# Altium schematic sheet power.SchDoc
size 420 x 297 mm; SheetNumber: 3
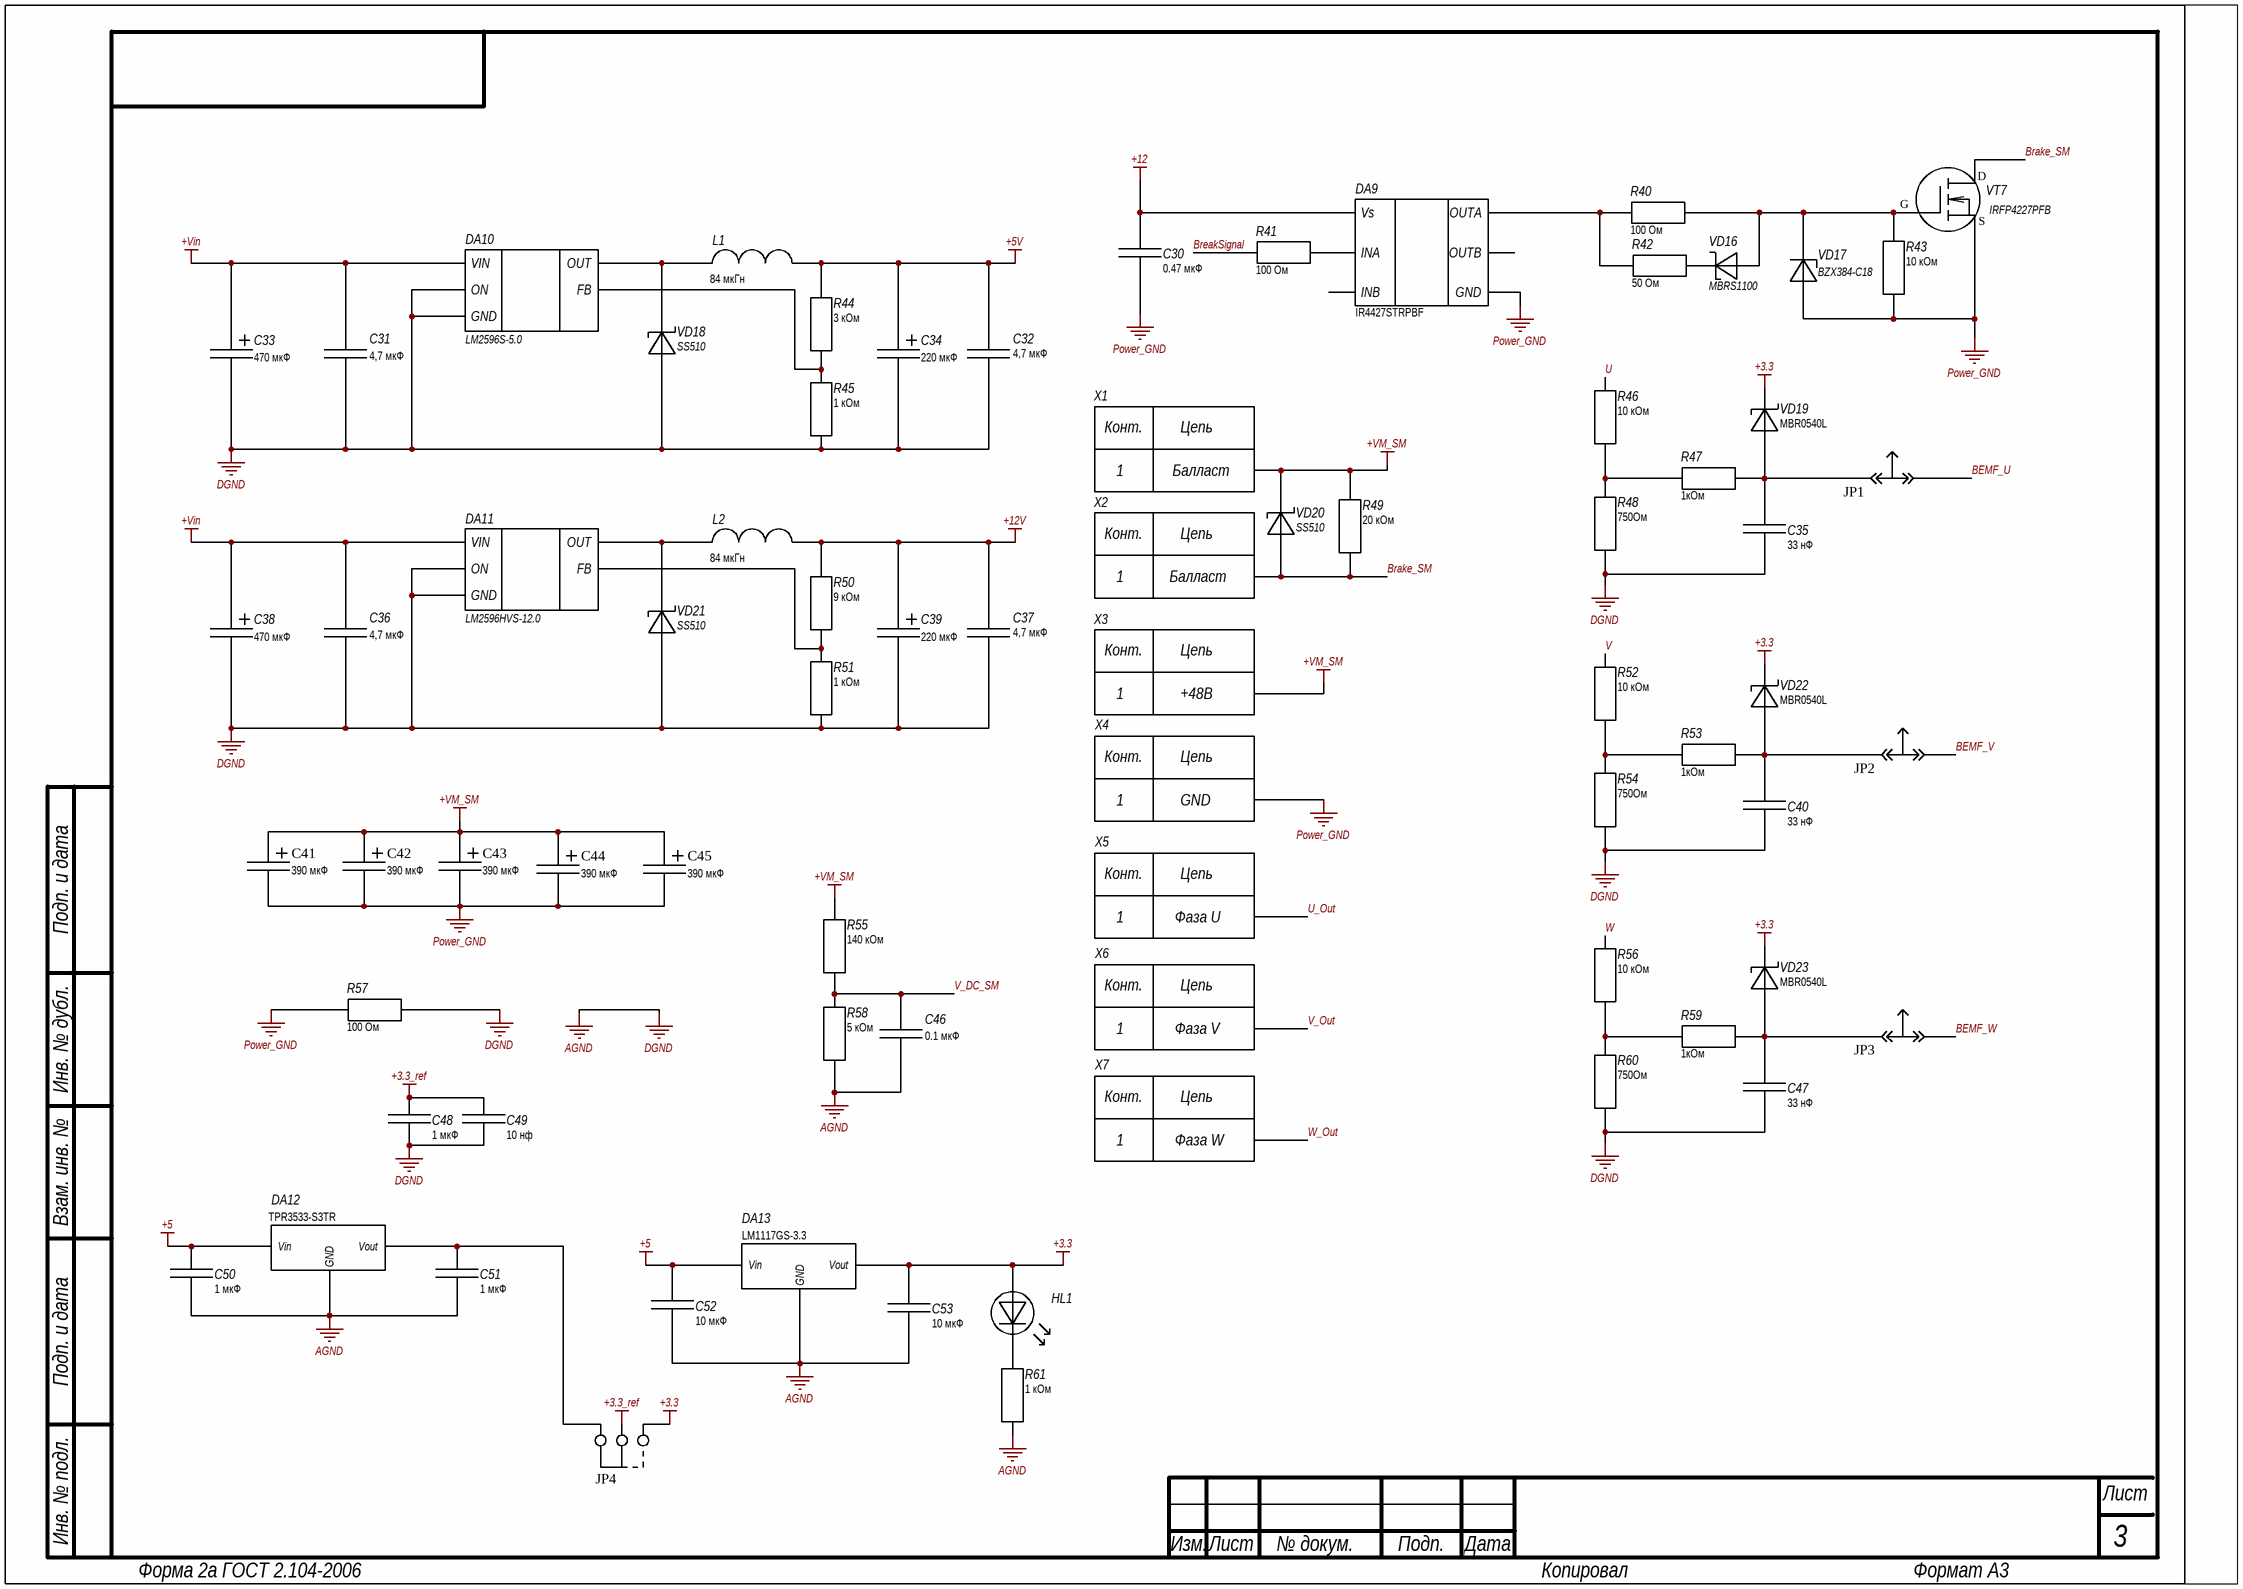
[diagram p0: power.SchDoc]

## Parts
1  Net Tie  [Net Tie]  (value not drawn)  (net tie, no BOM)
C30  value 0.47 мкФ  [CC1206]  (hidden comment: Capacitor)
C31  value 4,7 мкФ  [CC1206]  (hidden comment: Capacitor)
C32  value 4,7 мкФ  [CC1206]  (hidden comment: Capacitor)
C33  value 470 мкФ  [CAP-5-12.5]  (hidden comment: EXR471M50B)
C34  value 220 мкФ  [CAP-5-10]  (hidden comment: B41858C7227M)
C35  value 33 нФ  [CC0805]  (hidden comment: Capacitor)
C36  value 4,7 мкФ  [CC1206]  (hidden comment: Capacitor)
C37  value 4,7 мкФ  [CC1206]  (hidden comment: Capacitor)
C38  value 470 мкФ  [CAP-5-12.5]  (hidden comment: EXR471M50B)
C39  value 220 мкФ  [CAP-5-10]  (hidden comment: B41858C7227M)
C40  value 33 нФ  [CC0805]  (hidden comment: Capacitor)
C41  value 390 мкФ  [CAP-7.5-18]  (hidden comment: Сapacitor pol)
C42  value 390 мкФ  [CAP-7.5-18]  (hidden comment: Сapacitor pol)
C43  value 390 мкФ  [CAP-7.5-18]  (hidden comment: Сapacitor pol)
C44  value 390 мкФ  [CAP-7.5-18]  (hidden comment: Сapacitor pol)
C45  value 390 мкФ  [CAP-7.5-18]  (hidden comment: Сapacitor pol)
C46  value 0.1 мкФ  [CC0603]  (hidden comment: Capacitor)
C47  value 33 нФ  [CC0805]  (hidden comment: Capacitor)
C48  value 1 мкФ  [CC0603]  (hidden comment: Capacitor)
C49  value 10 нф  [CC0402]  (hidden comment: Capacitor)
C50  value 1 мкФ  [CC0805]  (hidden comment: Capacitor)
C51  value 1 мкФ  [CC0805]  (hidden comment: Capacitor)
C52  value 10 мкФ  [CC1206]  (hidden comment: Capacitor)
C53  value 10 мкФ  [CC1206]  (hidden comment: Capacitor)
DA9  IR4427STRPBF  [SO8]
DA10  LM2596S-5.0  [TO263-5L]
DA11  LM2596HVS-12.0  [TO263-5L]
DA12  TPR3533-S3TR  [SOT-23-5]
DA13  LM1117GS-3.3  [SOT-223]
HL1  LED  [CC1206]  (value not drawn)
JP1  Jumper-2  [PLS2]  (value not drawn)  (no BOM)
JP2  Jumper-2  [PLS2]  (value not drawn)  (no BOM)
JP3  Jumper-2  [PLS2]  (value not drawn)  (no BOM)
JP4  Jumper  [PLS3]  (value not drawn)
L1  value 84 мкГн  [CDRH127/LDNP-820MC]  (hidden comment: CDRH127/LDNP-820MC)
L2  value 84 мкГн  [CDRH127/LDNP-820MC]  (hidden comment: CDRH127/LDNP-820MC)
R40  value 100 Ом  [RC2512]  (hidden comment: Resistor)
R41  value 100 Ом  [RC0603]  (hidden comment: Resistor)
R42  value 50 Ом  [RC2512]  (hidden comment: Resistor)
R43  value 10 кОм  [RC0805]  (hidden comment: Resistor)
R44  value 3 кОм  [RC0805]  (hidden comment: Resistor)
R45  value 1 кОм  [RC0805]  (hidden comment: Resistor)
R46  value 10 кОм  [RC1206]  (hidden comment: Resistor)
R47  value 1кОм  [RC0805]  (hidden comment: Resistor)
R48  value 750Ом  [RC1206]  (hidden comment: Resistor)
R49  value 20 кОм  [RC1206]  (hidden comment: Resistor)
R50  value 9 кОм  [RC0805]  (hidden comment: Resistor)
R51  value 1 кОм  [RC0805]  (hidden comment: Resistor)
R52  value 10 кОм  [RC1206]  (hidden comment: Resistor)
R53  value 1кОм  [RC0805]  (hidden comment: Resistor)
R54  value 750Ом  [RC1206]  (hidden comment: Resistor)
R55  value 140 кОм  [RC1206]  (hidden comment: Resistor)
R56  value 10 кОм  [RC1206]  (hidden comment: Resistor)
R57  value 100 Ом  [RC2512]  (hidden comment: Resistor)
R58  value 5 кОм  [RC1206]  (hidden comment: Resistor)
R59  value 1кОм  [RC0805]  (hidden comment: Resistor)
R60  value 750Ом  [RC1206]  (hidden comment: Resistor)
R61  value 1 кОм  [RC0805]  (hidden comment: Resistor)
VD16  MBRS1100  [DO-214AA]
VD17  BZX384-C18  [SOD323]
VD18  SS510  [DO214AB]
VD19  MBR0540L  [SOD123]
VD20  SS510  [DO214AB]
VD21  SS510  [DO214AB]
VD22  MBR0540L  [SOD123]
VD23  MBR0540L  [SOD123]
VT7  IRFP4227PFB  [TO247-1]
X1  Connector-1  [PCBM4]  (value not drawn)
X2  Connector-1  [PCBM4]  (value not drawn)
X3  Connector-1  [PCBM4]  (value not drawn)
X4  Connector-1  [PCBM4]  (value not drawn)
X5  Connector-1  [PCBM4]  (value not drawn)
X6  Connector-1  [PCBM4]  (value not drawn)
X7  Connector-1  [PCBM4]  (value not drawn)

## Nets
+3.3: C53.1 DA13.2(Vout) HL1.A JP4.1 VD19.C VD22.C VD23.C
+3.3_ref: C48.1 C49.1 JP4.2
+5: C50.1 C52.1 DA12.1(Vin) DA13.3(Vin)
+5V: C32.2 C34.1 L1.2 R44.1
+12: C30.2 DA9.6(Vs)
+12V: C37.2 C39.1 L2.2 R50.1
+Vin: C31.2 C33.1 C36.2 C38.1 DA10.1(VIN) DA11.1(VIN)
+VM_SM: C41.1 C42.1 C43.1 C44.1 C45.1 R49.1 R55.1 VD20.C X1.1 X3.1
AGND: 1.1 C46.1 C50.2 C51.2 C52.2 C53.2 DA12.3(GND) DA13.1(GND) R58.2 R61.2
DGND: 1.2 C31.1 C32.1 C33.2 C34.2 C35.1 C36.1 C37.1 C38.2 C39.2 C40.1 C47.1 C48.2 C49.2 DA10.3(GND) DA10.5(ON) DA11.3(GND) DA11.5(ON) R45.2 R48.2 R51.2 R54.2 R57.1 R60.2 VD18.A VD21.A
Power_GND: C30.1 C41.2 C42.2 C43.2 C44.2 C45.2 DA9.3(GND) R43.2 R57.2 VD17.A VT7.S X4.1
BEMF_U: JP1.2
BEMF_V: JP2.2
BEMF_W: JP3.2
Brake_SM: R49.2 VD20.A VT7.D X2.1
BreakSignal: R41.2
U: R46.1
U_Out: X5.1
V: R52.1
V_DC_SM: C46.2 R55.2 R58.1
V_Out: X6.1
W: R56.1
W_Out: X7.1
NetC35_2: C35.2 JP1.1 R47.2 VD19.A
NetC40_2: C40.2 JP2.1 R53.2 VD22.A
NetC47_2: C47.2 JP3.1 R59.2 VD23.A
NetC51_1: C51.1 DA12.2(Vout) JP4.3
NetDA9_2: DA9.2(INA) R41.1
NetDA9_7: DA9.7(OUTA) R40.2 R42.2
NetDA10_2: DA10.2(OUT) L1.1 VD18.C
NetDA10_4: DA10.4(FB) R44.2 R45.1
NetDA11_2: DA11.2(OUT) L2.1 VD21.C
NetDA11_4: DA11.4(FB) R50.2 R51.1
NetHL1_C: HL1.C R61.1
NetR40_1: R40.1 R43.1 VD16.A VD17.C VT7.G
NetR42_1: R42.1 VD16.C
NetR46_2: R46.2 R47.1 R48.1
NetR52_2: R52.2 R53.1 R54.1
NetR56_2: R56.2 R59.1 R60.1

Not connected (* = marked no-connect by the designer): DA9 4(INB) 5(OUTB)

## Notes on the sheet
- (near X1) Балласт
- (near X2) Балласт
- (near X3) +48В
- (near X4) GND
- (near X5) Фаза U
- (near X6) Фаза V
- (near X7) Фаза W
- Подп. и дата
- Инв. № дубл.
- Взам. инв. №
- Инв. № подл.
- Изм.
- Лист
- № докум.
- Подп.
- Дата
- Форма 2а ГОСТ 2.104-2006
- Копировал
- Формат А3
- (in symbol Connector-1) Конт.; Цепь

## Library data of the parts
C30 C35 C40 C47 = Capacitor: Voltage: 50В; ComponentLink1Description: Product link; ComponentLink1URL: *; GOST_Name_1: =Name; GOST_Name_2: 50В; GOST_Name_0: -
  C30: Name: CC1206; GOST_Name_3: 0.47 мкФ
  C35 C40 C47: Name: CC0805; GOST_Name_3: 33 нФ
C31 C32 C36 C37 C46 = Capacitor: Voltage: 50 В; ComponentLink1Description: Product link; ComponentLink1URL: *; GOST_Name_1: =Name; GOST_Name_2: 50 В; GOST_Name_0: -
  C31 C32 C36 C37: Name: CC1206; GOST_Name_3: 4,7 мкФ
  C46: Name: CC0603; GOST_Name_3: 0.1 мкФ
C33 C38 = Сapacitor pol: Voltage: 50 В; ComponentLink1Description: Product link; ComponentLink1URL: https://www.promelec.ru/product/396474/; Type: *; Name: EXR471M50B; GOST_Name_1: =Name; GOST_Name_2: 50 В; GOST_Name_3: 470 мкФ; GOST_Name_0: -
C34 C39 = Сapacitor pol: Voltage: 35 В; ComponentLink1Description: Product link; ComponentLink1URL: https://www.promelec.ru/product/134576/; Type: *; Name: B41858C7227M; GOST_Name_1: =Name; GOST_Name_2: 35 В; GOST_Name_3: 220 мкФ; GOST_Name_0: -
C41-C45 = Сapacitor pol: Name: B41858C9397M-100 В-390 мкФ; ComponentLink1Description: Product link; ComponentLink1URL: *; Type: *; GOST_Name_1: B41858C9397M-100 В-390 мкФ
C48 = Capacitor: Voltage: 10В; ComponentLink1Description: Product link; ComponentLink1URL: *; Name: CC0603; GOST_Name_1: =Name; GOST_Name_2: 10В; GOST_Name_3: 1 мкФ; GOST_Name_0: -
C49 = Capacitor: Voltage: 16В; ComponentLink1Description: Product link; ComponentLink1URL: *; Name: CC0402; GOST_Name_1: =Name; GOST_Name_2: 16В; GOST_Name_3: 10 нф; GOST_Name_0: -
C50-C53 = Capacitor: Voltage: 25 В; ComponentLink1Description: Product link; ComponentLink1URL: *; GOST_Name_1: =Name; GOST_Name_2: 25 В; GOST_Name_0: -
  C50 C51: Name: CC0805; GOST_Name_3: 1 мкФ
  C52 C53: Name: CC1206; GOST_Name_3: 10 мкФ
DA9 = IR4427STRPBF: Драйвер сдвоенный нижнего плеча 8SOIC; Name: IR4427STRPBF, ф. Infineon Technologies; ComponentLink1Description: Product link; ComponentLink1URL: https://www.promelec.ru/product/203606/; GOST_Name_1: IR4427STRPBF, ф. Infineon Technologies
DA10 DA11 = LM2596: GOST_Name_2: ' ф.  UMW Youtai Semiconductor'; ComponentLink1Description: Product link; ComponentLink1URL: https://www.promelec.ru/search/?query=LM2596; GOST_Name_1: =Name
  DA10: Name: LM2596S-5.0
  DA11: Name: LM2596HVS-12.0
DA12 = TPR3533-S3TR: Источник опорного напряжения 3.3В; Name: TPR3533-S3TR ф 3PEAK; ComponentLink1Description: Product link; ComponentLink1URL: https://www.chipdip.ru/product0/8017231744; GOST_Name_1: TPR3533-S3TR ф 3PEAK
DA13 = LM1117GS-3.3: Линейный регулятор с низким падением напряжения, +3.3 В, 1А; Name: LM1117GS-3.3, ф TAEJIN TECHNOLOGY Co., Ltd.; ComponentLink1Description: Product link; ComponentLink1URL: https://www.chipdip.ru/product/lm1117gs-3.3; GOST_Name_1: LM1117GS-3.3, ф TAEJIN TECHNOLOGY Co., Ltd.
HL1 = LED: Name: GNL-1206EC; ComponentLink1Description: Product link; GOST_Name_1: GNL-1206EC
L1 L2 = Inductor: Current: 2.4 А; Name: CDRH127/LDNP-820MC; ComponentLink1Description: Product link; ComponentLink1URL: https://www.promelec.ru/product/347591/; GOST_Name_1: =Name; GOST_Name_2: 2.4 А; GOST_Name_3: 84 мкГн; GOST_Name_0: -
R40 R42 R57 = Resistor: Power: 1 Вт; ComponentLink1Description: Product link; ComponentLink1URL: *; Name: RC2512; GOST_Name_1: =Name; GOST_Name_2: 1 Вт; GOST_Name_0: -
  R40 R57: GOST_Name_3: 100 Ом
  R42: GOST_Name_3: 50 Ом
R41 = Resistor: Power: 100 мВт; ComponentLink1Description: Product link; ComponentLink1URL: *; Name: RC0603; GOST_Name_1: =Name; GOST_Name_2: 100 мВт; GOST_Name_3: 100 Ом; GOST_Name_0: -
R43-R48 R50-R54 R56 R59-R61 = Resistor: Power: 125 мВт; ComponentLink1Description: Product link; ComponentLink1URL: *; GOST_Name_1: =Name; GOST_Name_2: 125 мВт; GOST_Name_0: -
  R43: Name: RC0805; GOST_Name_3: 10 кОм
  R44: Name: RC0805; GOST_Name_3: 3 кОм
  R45 R51 R61: Name: RC0805; GOST_Name_3: 1 кОм
  R46 R52 R56: Name: RC1206; GOST_Name_3: 10 кОм
  R47 R53 R59: Name: RC0805; GOST_Name_3: 1кОм
  R48 R54 R60: Name: RC1206; GOST_Name_3: 750Ом
  R50: Name: RC0805; GOST_Name_3: 9 кОм
R49 R55 R58 = Resistor: Power: 250 мВт; ComponentLink1Description: Product link; ComponentLink1URL: *; Name: RC1206; GOST_Name_1: =Name; GOST_Name_2: 250 мВт; GOST_Name_0: -
  R49: GOST_Name_3: 20 кОм
  R55: GOST_Name_3: 140 кОм
  R58: GOST_Name_3: 5 кОм
VD16 = Shotki: Name: MBRS1100, 100В, 1А, ф. Sunmate Electronics; ComponentLink1Description: Product link; ComponentLink1URL: https://www.chipdip.ru/product/mbrs1100; GOST_Name_1: MBRS1100, 100В, 1А, ф. Sunmate Electronics
VD17 = Zener diode: Name: BZX384-C18,115, Стабилитрон 18В 0.3Вт, ф Nexperia; ComponentLink1Description: Product link; ComponentLink1URL: https://www.chipdip.ru/product/bzx384-c18.115; GOST_Name_1: BZX384-C18,115, Стабилитрон 18В 0.3Вт, ф Nexperia
VD18 VD20 VD21 = Shotki: Name: SS510, 100В, 5А, ф. Hottech Co. Ltd; ComponentLink1Description: Product link; ComponentLink1URL: https://www.promelec.ru/product/386699/; GOST_Name_1: SS510, 100В, 5А, ф. Hottech Co. Ltd
VD19 VD22 VD23 = Shotki: Name: MBR0540L, 40В, 0.5А, ф. Hottech; ComponentLink1Description: Product link; GOST_Name_1: MBR0540L, 40В, 0.5А, ф. Hottech
VT7 = N-MOSFET: ComponentLink1Description: Product link; ComponentLink1URL: https://www.chipdip.ru/product/irfp4710pbf; GOST_Name_1: IRFP4227PFB; Name: IRFP4227PFB
X1-X7 = Connector-1: Name: Соединение винтовое 10х5мм, М4; ComponentLink1Description: Product link; GOST_Name_1: Соединение винтовое 10х5мм, М4
1 = Net Tie: ComponentLink1Description: Product link; ComponentLink1URL: https://www.chipdip.ru/product/stps2h100a-2
JP1-JP3 = Jumper-2: ComponentLink1Description: Product link; ComponentLink1URL: https://www.chipdip.ru/product/stps2h100a-2
JP4 = Jumper: ComponentLink1Description: Product link; ComponentLink1URL: https://www.chipdip.ru/product/stps2h100a-2